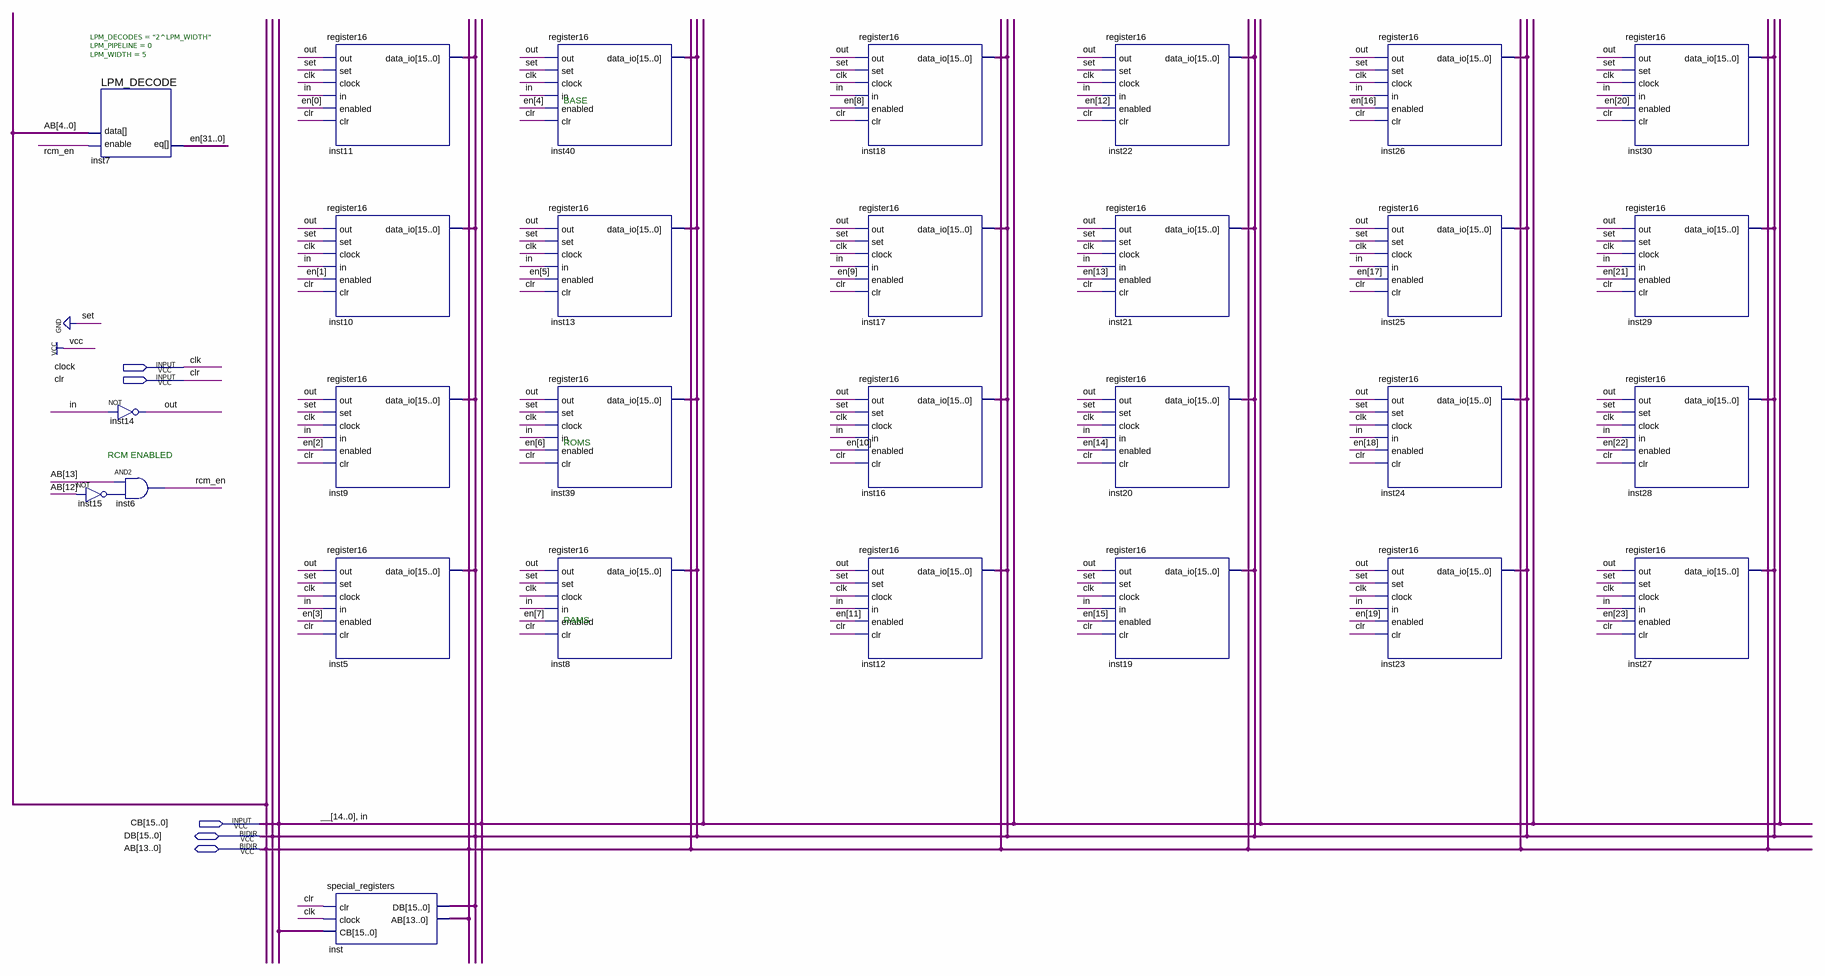
[diagram p0: schematic sheet]
// Quartus schematic RCM.bdf as structural Verilog: 29 symbols, 5 pins
module RCM (
  input  clock,
  input  clr,
  input  [15:0] CB,
  inout  [15:0] DB,
  inout  [13:0] AB
);

  wire inst15_out, out, rcm_en;
  wire [31:0] en;

  LPM_DECODE #(.LPM_DECODES("2^LPM_WIDTH"), .LPM_PIPELINE(0), .LPM_WIDTH(5)) inst7 (
    .enable(rcm_en), .data(AB[4:0]), .eq(en));
  not inst14 (out, CB[0]);
  not inst15 (inst15_out, AB[12]);
  and inst6 (rcm_en, AB[13], inst15_out);
  register16 inst11 (.out(out), .set(1'b0), .clock(clock), .in(CB[0]), .enabled(en[0]), .clr(clr), .data_io(DB));
  register16 inst10 (.out(out), .set(1'b0), .clock(clock), .in(CB[0]), .enabled(en[1]), .clr(clr), .data_io(DB));
  register16 inst9 (.out(out), .set(1'b0), .clock(clock), .in(CB[0]), .enabled(en[2]), .clr(clr), .data_io(DB));
  register16 inst5 (.out(out), .set(1'b0), .clock(clock), .in(CB[0]), .enabled(en[3]), .clr(clr), .data_io(DB));
  special_registers inst (.clr(clr), .clock(clock), .CB(CB), .DB(DB), .AB(AB));
  register16 inst40 (.out(out), .set(1'b0), .clock(clock), .in(CB[0]), .enabled(en[4]), .clr(clr), .data_io(DB));
  register16 inst13 (.out(out), .set(1'b0), .clock(clock), .in(CB[0]), .enabled(en[5]), .clr(clr), .data_io(DB));
  register16 inst39 (.out(out), .set(1'b0), .clock(clock), .in(CB[0]), .enabled(en[6]), .clr(clr), .data_io(DB));
  register16 inst8 (.out(out), .set(1'b0), .clock(clock), .in(CB[0]), .enabled(en[7]), .clr(clr), .data_io(DB));
  register16 inst18 (.out(out), .set(1'b0), .clock(clock), .in(CB[0]), .enabled(en[8]), .clr(clr), .data_io(DB));
  register16 inst17 (.out(out), .set(1'b0), .clock(clock), .in(CB[0]), .enabled(en[9]), .clr(clr), .data_io(DB));
  register16 inst16 (.out(out), .set(1'b0), .clock(clock), .in(CB[0]), .enabled(en[10]), .clr(clr), .data_io(DB));
  register16 inst12 (.out(out), .set(1'b0), .clock(clock), .in(CB[0]), .enabled(en[11]), .clr(clr), .data_io(DB));
  register16 inst22 (.out(out), .set(1'b0), .clock(clock), .in(CB[0]), .enabled(en[12]), .clr(clr), .data_io(DB));
  register16 inst21 (.out(out), .set(1'b0), .clock(clock), .in(CB[0]), .enabled(en[13]), .clr(clr), .data_io(DB));
  register16 inst20 (.out(out), .set(1'b0), .clock(clock), .in(CB[0]), .enabled(en[14]), .clr(clr), .data_io(DB));
  register16 inst19 (.out(out), .set(1'b0), .clock(clock), .in(CB[0]), .enabled(en[15]), .clr(clr), .data_io(DB));
  register16 inst26 (.out(out), .set(1'b0), .clock(clock), .in(CB[0]), .enabled(en[16]), .clr(clr), .data_io(DB));
  register16 inst25 (.out(out), .set(1'b0), .clock(clock), .in(CB[0]), .enabled(en[17]), .clr(clr), .data_io(DB));
  register16 inst24 (.out(out), .set(1'b0), .clock(clock), .in(CB[0]), .enabled(en[18]), .clr(clr), .data_io(DB));
  register16 inst23 (.out(out), .set(1'b0), .clock(clock), .in(CB[0]), .enabled(en[19]), .clr(clr), .data_io(DB));
  register16 inst30 (.out(out), .set(1'b0), .clock(clock), .in(CB[0]), .enabled(en[20]), .clr(clr), .data_io(DB));
  register16 inst29 (.out(out), .set(1'b0), .clock(clock), .in(CB[0]), .enabled(en[21]), .clr(clr), .data_io(DB));
  register16 inst28 (.out(out), .set(1'b0), .clock(clock), .in(CB[0]), .enabled(en[22]), .clr(clr), .data_io(DB));
  register16 inst27 (.out(out), .set(1'b0), .clock(clock), .in(CB[0]), .enabled(en[23]), .clr(clr), .data_io(DB));

  // Other names for the same wires on the sheet: in = CB[0]; __[14:0] = CB[15:1]; clk = clock

  // Notes on the sheet:
  //   BASE
  //   ROMS
  //   RCM ENABLED
  //   RAMS
endmodule
